# EAGLE board MDB1986 (EAGLE 9.0.0)
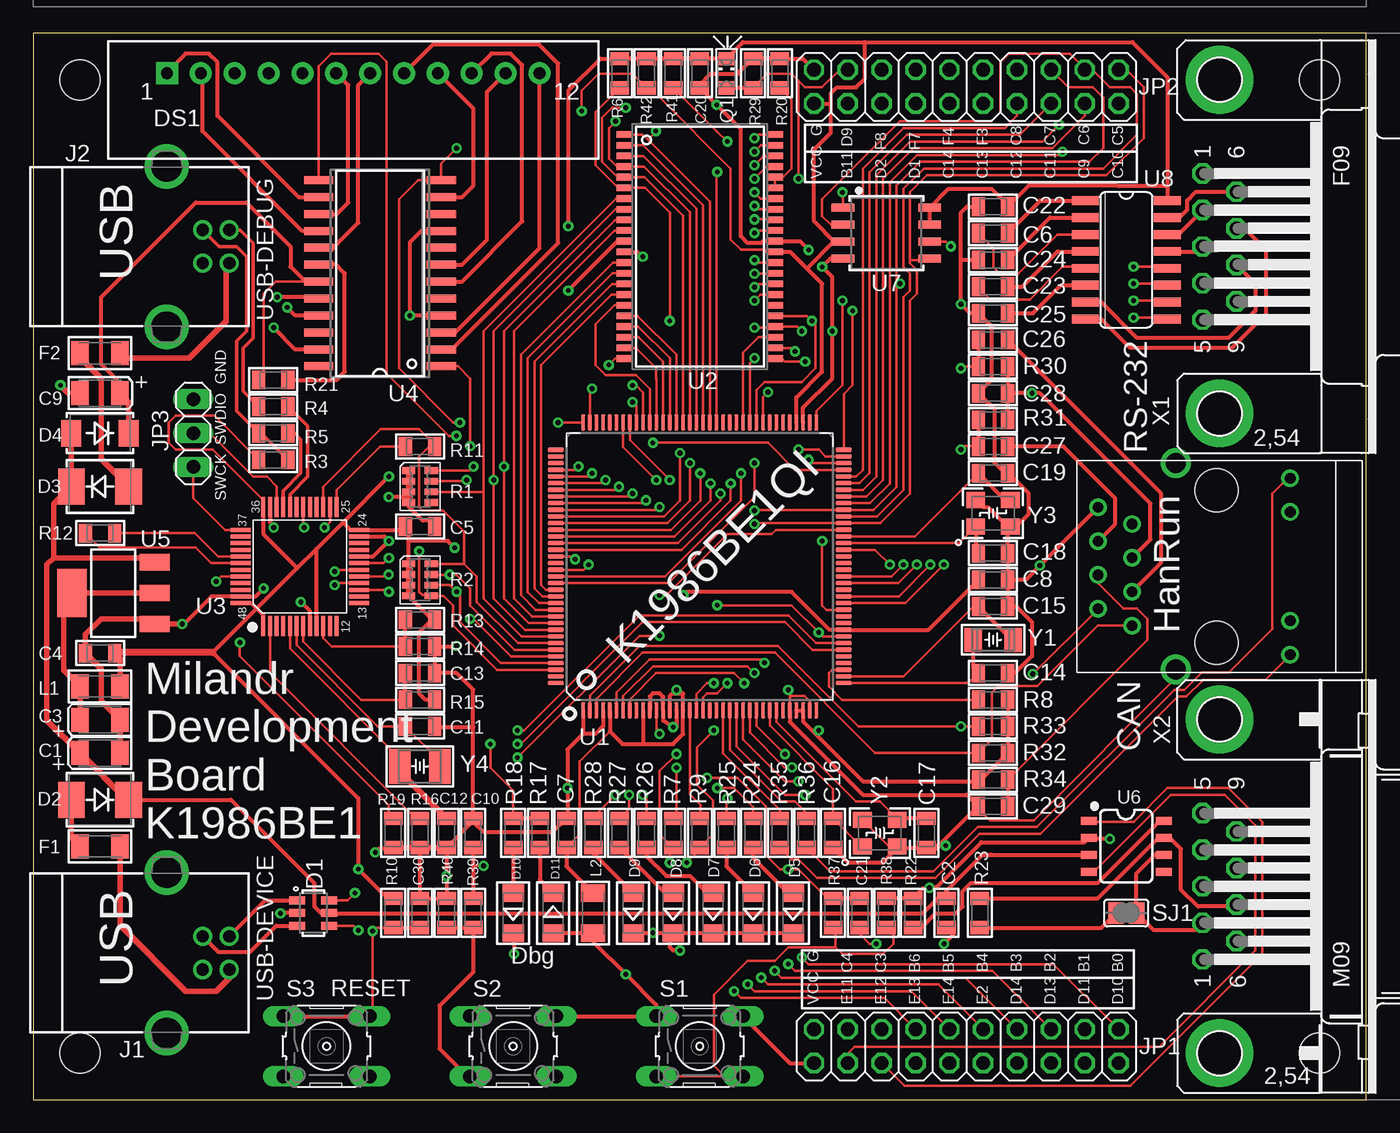
[diagram p1: board, top side]
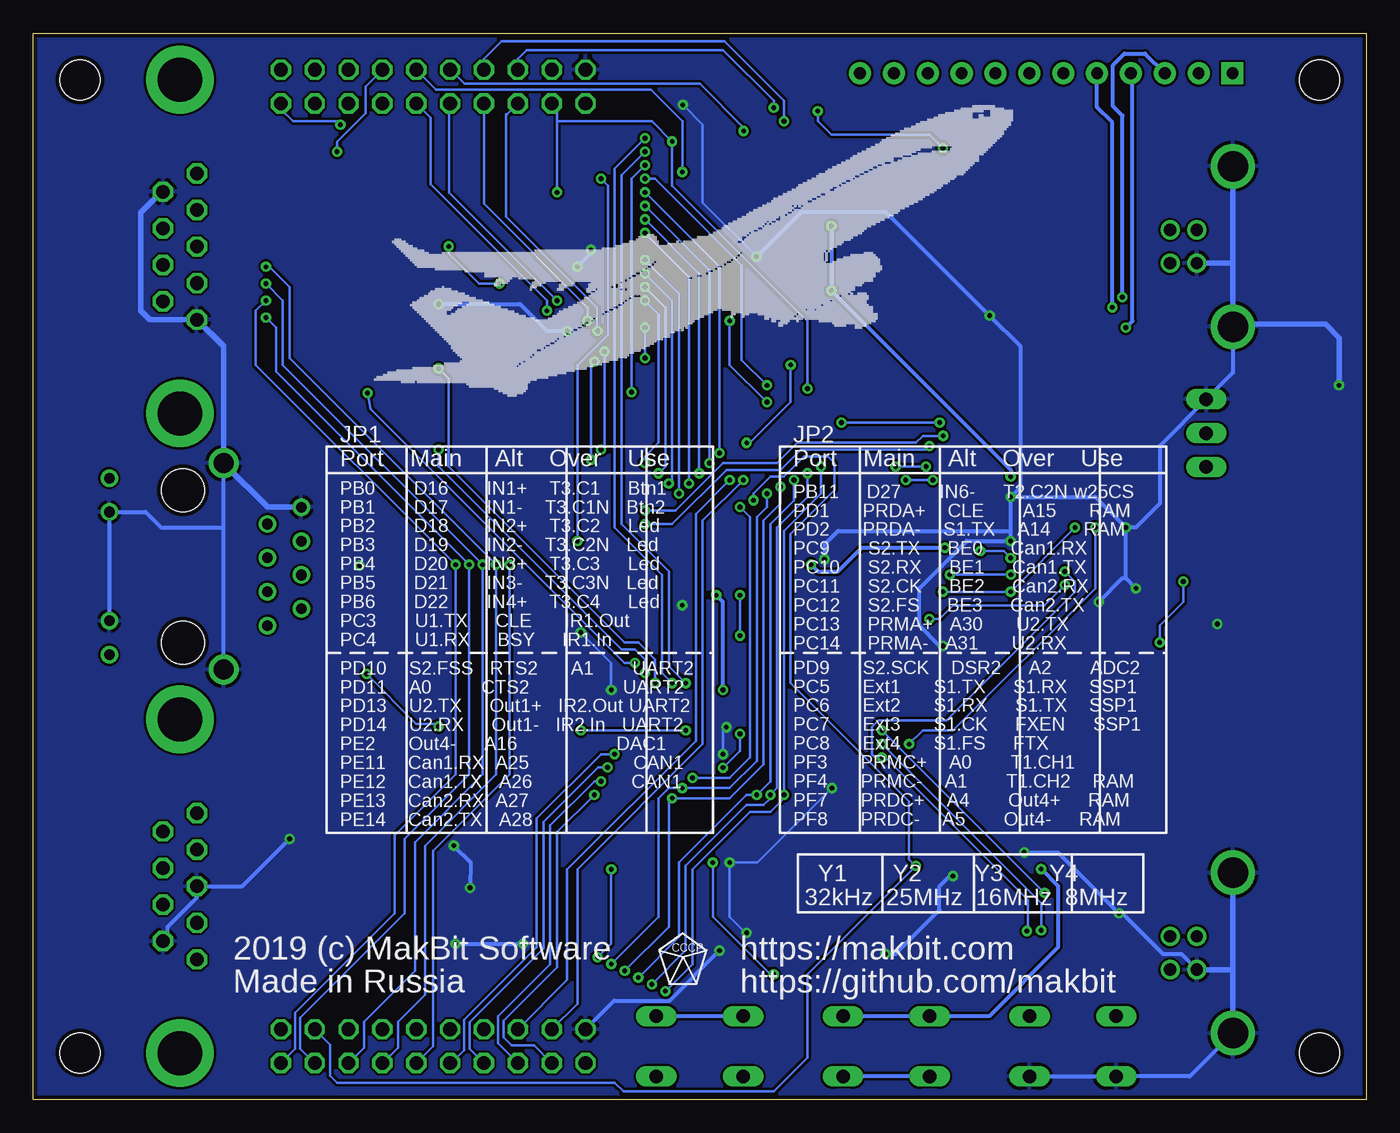
[diagram p2: board, bottom side, seen from below]

Size 100 x 80 mm. Coordinates in mm from the lower left corner, seen from the top.
Outline: 0,0 100,0 100,80 0,80 0,0
Copper layers (1*16): Top 0.035mm / dielectric 1.5mm / Bottom 0.035mm
Design rules "default *": minimum track width 8mil, minimum drill 0.35mm, track to track 7mil, track to pad 7mil, pad to pad 7mil, via to via 7mil, smd to smd 7mil, copper to edge 12mil, drill to drill 8mil, minimum pad ring 10mil, minimum via ring 8mil, stop-mask expansion 4mil, vias tented up to drill 14mil, thermal gap 10mil
Holes 3 mm at 96.5,76.5 96.5,3.5 3.5,3.5 3.5,76.5

## Footprints (pad centres in the part's own frame; a part is rotated, then mirrored left to right if it is on the bottom)
RCL-1206F-POL = smd 1.3 x 1.8: + 1.5,0; - -1.5,0
RCL-0805F = smd 1 x 1.4: 1 -1.1,0; 2 1.1,0
SOT-23-6L = smd 0.6 x 1.2: 1 -0.95,-1.2; 2 0,-1.2; 3 0.95,-1.2; 4 0.95,1.2; 5 0,1.2; 6 -0.95,1.2
DO-214AA(SMB) = smd 2 x 2.7: A -2.15,0; C 2.15,0
DO-214AC(SMA) = smd 1.5 x 2: A -2.15,0; C 2.15,0
LED-1206F = smd 1.3 x 1.6: A -1.5,0; C 1.5,0
LED-7SEG-12P2.54 = drill 0.889 pad 1.651 square: 1 -13.97,2 | drill 0.889 pad 1.651: 2 -11.43,2; 3 -8.89,2; 4 -6.35,2; 5 -3.81,2; 6 -1.27,2; 7 1.27,2; 8 3.81,2; 9 6.35,2; 10 8.89,2; 11 11.43,2; 12 13.97,2
RCL-1206F = smd 1.3 x 1.8: 1 -1.5,0; 2 1.5,0
USB-TYPE-B-4P = drill 0.92 pad 1.27: 1_VBUS 4.71,-1.25; 2_DM 4.71,1.25; 3_DP 2.71,1.25; 4_GND 2.71,-1.25 | drill 2.3 pad 3: M1 0,6.02; M2 0,-6.02
2X10 = drill 1.016 octagon: 1 -11.43,-1.27; 2 -11.43,1.27; 3 -8.89,-1.27; 4 -8.89,1.27; 5 -6.35,-1.27; 6 -6.35,1.27; 7 -3.81,-1.27; 8 -3.81,1.27; 9 -1.27,-1.27; 10 -1.27,1.27; 11 1.27,-1.27; 12 1.27,1.27; 13 3.81,-1.27; 14 3.81,1.27; 15 6.35,-1.27; 16 6.35,1.27; 17 8.89,-1.27; 18 8.89,1.27; 19 11.43,-1.27; 20 11.43,1.27
1X03 = drill 1.016 long: 1 -2.54,0; 2 0,0; 3 2.54,0
PT17-21C-L41-TR8 = smd 1.2 x 1: C 0,1.1; E 0,-1.1
RA-1206-X4 = smd 0.5 x 1: 1 -1.2,-0.85; 2 -0.4,-0.85; 3 0.4,-0.85; 4 1.2,-0.85; 5 1.2,0.85; 6 0.4,0.85; 7 -0.4,0.85; 8 -1.2,0.85
BUTTON-B3F-10XX = drill 1.016 long: 1 -3.251,2.261; 2 3.251,2.261; 3 -3.251,-2.261; 4 3.251,-2.261
SJ = smd 1.168 x 1.6: 1 -0.762,0; 2 0.762,0
LQFP144-0.5-20X20M = smd 0.3 x 1.2: 1 -8.75,-10.8; 2 -8.25,-10.8; 3 -7.75,-10.8; 4 -7.25,-10.8; 5 -6.75,-10.8; 6 -6.25,-10.8; 7 -5.75,-10.8; 8 -5.25,-10.8; 9 -4.75,-10.8; 10 -4.25,-10.8; 11 -3.75,-10.8; 12 -3.25,-10.8; 13 -2.75,-10.8; 14 -2.25,-10.8; 15 -1.75,-10.8; 16 -1.25,-10.8; 17 -0.75,-10.8; 18 -0.25,-10.8; 19 0.25,-10.8; 20 0.75,-10.8; 21 1.25,-10.8; 22 1.75,-10.8; 23 2.25,-10.8; 24 2.75,-10.8; 25 3.25,-10.8; 26 3.75,-10.8; 27 4.25,-10.8; 28 4.75,-10.8; 29 5.25,-10.8; 30 5.75,-10.8; 31 6.25,-10.8; 32 6.75,-10.8; 33 7.25,-10.8; 34 7.75,-10.8; 35 8.25,-10.8; 36 8.75,-10.8; 73 8.75,10.8; 74 8.25,10.8; 75 7.75,10.8; 76 7.25,10.8; 77 6.75,10.8; 78 6.25,10.8; 79 5.75,10.8; 80 5.25,10.8; 81 4.75,10.8; 82 4.25,10.8; 83 3.75,10.8; 84 3.25,10.8; 85 2.75,10.8; 86 2.25,10.8; 87 1.75,10.8; 88 1.25,10.8; 89 0.75,10.8; 90 0.25,10.8; 91 -0.25,10.8; 92 -0.75,10.8; 93 -1.25,10.8; 94 -1.75,10.8; 95 -2.25,10.8; 96 -2.75,10.8; 97 -3.25,10.8; 98 -3.75,10.8; 99 -4.25,10.8; 100 -4.75,10.8; 101 -5.25,10.8; 102 -5.75,10.8; 103 -6.25,10.8; 104 -6.75,10.8; 105 -7.25,10.8; 106 -7.75,10.8; 107 -8.25,10.8; 108 -8.75,10.8 | smd 1.2 x 0.3: 37 10.8,-8.75; 38 10.8,-8.25; 39 10.8,-7.75; 40 10.8,-7.25; 41 10.8,-6.75; 42 10.8,-6.25; 43 10.8,-5.75; 44 10.8,-5.25; 45 10.8,-4.75; 46 10.8,-4.25; 47 10.8,-3.75; 48 10.8,-3.25; 49 10.8,-2.75; 50 10.8,-2.25; 51 10.8,-1.75; 52 10.8,-1.25; 53 10.8,-0.75; 54 10.8,-0.25; 55 10.8,0.25; 56 10.8,0.75; 57 10.8,1.25; 58 10.8,1.75; 59 10.8,2.25; 60 10.8,2.75; 61 10.8,3.25; 62 10.8,3.75; 63 10.8,4.25; 64 10.8,4.75; 65 10.8,5.25; 66 10.8,5.75; 67 10.8,6.25; 68 10.8,6.75; 69 10.8,7.25; 70 10.8,7.75; 71 10.8,8.25; 72 10.8,8.75; 109 -10.8,8.75; 110 -10.8,8.25; 111 -10.8,7.75; 112 -10.8,7.25; 113 -10.8,6.75; 114 -10.8,6.25; 115 -10.8,5.75; 116 -10.8,5.25; 117 -10.8,4.75; 118 -10.8,4.25; 119 -10.8,3.75; 120 -10.8,3.25; 121 -10.8,2.75; 122 -10.8,2.25; 123 -10.8,1.75; 124 -10.8,1.25; 125 -10.8,0.75; 126 -10.8,0.25; 127 -10.8,-0.25; 128 -10.8,-0.75; 129 -10.8,-1.25; 130 -10.8,-1.75; 131 -10.8,-2.25; 132 -10.8,-2.75; 133 -10.8,-3.25; 134 -10.8,-3.75; 135 -10.8,-4.25; 136 -10.8,-4.75; 137 -10.8,-5.25; 138 -10.8,-5.75; 139 -10.8,-6.25; 140 -10.8,-6.75; 141 -10.8,-7.25; 142 -10.8,-7.75; 143 -10.8,-8.25; 144 -10.8,-8.75
TSOP2-44-400BF = smd 0.5 x 1.2: 1 -8.4,-5.627; 2 -7.6,-5.627; 3 -6.8,-5.627; 4 -6,-5.627; 5 -5.2,-5.627; 6 -4.4,-5.627; 7 -3.6,-5.627; 8 -2.8,-5.627; 9 -2,-5.627; 10 -1.2,-5.627; 11 -0.4,-5.627; 12 0.4,-5.627; 13 1.2,-5.627; 14 2,-5.627; 15 2.8,-5.627; 16 3.6,-5.627; 17 4.4,-5.627; 18 5.2,-5.627; 19 6,-5.627; 20 6.8,-5.627; 21 7.6,-5.627; 22 8.4,-5.627; 23 8.4,5.627; 24 7.6,5.627; 25 6.8,5.627; 26 6,5.627; 27 5.2,5.627; 28 4.4,5.627; 29 3.6,5.627; 30 2.8,5.627; 31 2,5.627; 32 1.2,5.627; 33 0.4,5.627; 34 -0.4,5.627; 35 -1.2,5.627; 36 -2,5.627; 37 -2.8,5.627; 38 -3.6,5.627; 39 -4.4,5.627; 40 -5.2,5.627; 41 -6,5.627; 42 -6.8,5.627; 43 -7.6,5.627; 44 -8.4,5.627
LQFP48-0.5-7X7MM = smd 1.5 x 0.3: 1 -4.45,2.75; 2 -4.45,2.25; 3 -4.45,1.75; 4 -4.45,1.25; 5 -4.45,0.75; 6 -4.45,0.25; 7 -4.45,-0.25; 8 -4.45,-0.75; 9 -4.45,-1.25; 10 -4.45,-1.75; 11 -4.45,-2.25; 12 -4.45,-2.75; 25 4.45,-2.75; 26 4.45,-2.25; 27 4.45,-1.75; 28 4.45,-1.25; 29 4.45,-0.75; 30 4.45,-0.25; 31 4.45,0.25; 32 4.45,0.75; 33 4.45,1.25; 34 4.45,1.75; 35 4.45,2.25; 36 4.45,2.75 | smd 0.3 x 1.5: 13 -2.75,-4.45; 14 -2.25,-4.45; 15 -1.75,-4.45; 16 -1.25,-4.45; 17 -0.75,-4.45; 18 -0.25,-4.45; 19 0.25,-4.45; 20 0.75,-4.45; 21 1.25,-4.45; 22 1.75,-4.45; 23 2.25,-4.45; 24 2.75,-4.45; 37 2.75,4.45; 38 2.25,4.45; 39 1.75,4.45; 40 1.25,4.45; 41 0.75,4.45; 42 0.25,4.45; 43 -0.25,4.45; 44 -0.75,4.45; 45 -1.25,4.45; 46 -1.75,4.45; 47 -2.25,4.45; 48 -2.75,4.45
SO24W = smd 0.6 x 2.2: 1 -6.985,-4.6; 2 -5.715,-4.6; 3 -4.445,-4.6; 4 -3.175,-4.6; 5 -1.905,-4.6; 6 -0.635,-4.6; 7 0.635,-4.6; 8 1.905,-4.6; 9 3.175,-4.6; 10 4.445,-4.6; 11 5.715,-4.6; 12 6.985,-4.6; 13 6.985,4.6; 14 5.715,4.6; 15 4.445,4.6; 16 3.175,4.6; 17 1.905,4.6; 18 0.635,4.6; 19 -0.635,4.6; 20 -1.905,4.6; 21 -3.175,4.6; 22 -4.445,4.6; 23 -5.715,4.6; 24 -6.985,4.6
SOT223 = smd 1.219 x 2.235: 1 -2.311,-3.099; 2 0,-3.099; 3 2.311,-3.099 | smd 3.6 x 2.2: 4 0,3.099
SO08 = smd 0.6 x 1.2: 1 -1.905,-2.8; 2 -0.635,-2.8; 3 0.635,-2.8; 4 1.905,-2.8; 5 1.905,2.8; 6 0.635,2.8; 7 -0.635,2.8; 8 -1.905,2.8
SOIC-8 = smd 0.61 x 1.702: 1 -1.905,-3.251; 2 -0.635,-3.251; 3 0.635,-3.251; 4 1.905,-3.251; 5 1.905,3.251; 6 0.635,3.251; 7 -0.635,3.251; 8 -1.905,3.251
SO16 = smd 0.66 x 2.032: 1 -4.445,-3.073; 2 -3.175,-3.073; 3 -1.905,-3.073; 4 -0.635,-3.073; 5 0.635,-3.073; 6 1.905,-3.073; 7 3.175,-3.073; 8 4.445,-3.073; 9 4.445,3.073; 10 3.175,3.073; 11 1.905,3.073; 12 0.635,3.073; 13 -0.635,3.073; 14 -1.905,3.073; 15 -3.175,3.073; 16 -4.445,3.073
F09HP = drill 1.016 octagon: 1 -5.486,-1.27; 2 -2.743,-1.27; 3 0,-1.27; 4 2.743,-1.27; 5 5.486,-1.27; 6 -4.115,1.27; 7 -1.372,1.27; 8 1.372,1.27; 9 4.115,1.27 | drill 3.302 pad 5.08: G1 -12.522,0; G2 12.522,0
M09HP = drill 1.016 octagon: 1 -5.486,1.27; 2 -2.743,1.27; 3 0,1.27; 4 2.743,1.27; 5 5.486,1.27; 6 -4.115,-1.27; 7 -1.372,-1.27; 8 1.372,-1.27; 9 4.115,-1.27 | drill 3.302 pad 5.08: G1 -12.522,0; G2 12.522,0
RJ45 = drill 0.8: P1 4.44,-6.57; P2 3.18,-9.11; P3 1.9,-6.57; P4 0.64,-9.11; P5 -0.64,-6.57; P6 -1.9,-9.11; P7 -3.18,-6.57; P8 -4.44,-9.11; P9 6.625,5.3; P10 4.085,5.3; P11 -4.085,5.3; P12 -6.625,5.3 | drill 1.5: SHIELD1 7.745,-3.27; SHIELD2 -7.745,-3.27 | hole 3.25: -5.715,-0.22; 5.715,-0.22
XTAL-FC-135 = smd 1.3 x 1.8: 1 -1.5,0; 2 1.5,0
XTAL-FA-238 = smd 1.4 x 1.2: 1 -1.3,-1; 2 1.3,-1; 3 1.3,1; 4 -1.3,1
XTAL-NX3225 = smd 1.6 x 2.6: 1 -1.5,0; 2 1.5,0

## Placement (x,y rotation side)
C1  10u  [RCL-1206F-POL]  5,26 180 top
C2  1u  [RCL-0805F]  68.5,14 270 top
C3  10u  [RCL-1206F-POL]  5,28.5 180 top
C4  1u  [RCL-0805F]  5,33.5 180 top
C5  1u  [RCL-0805F]  29,43 0 top
C6  1u  [RCL-0805F]  72,67 180 top
C7  100n  [RCL-0805F]  40,20 90 top
C8  100n  [RCL-0805F]  72,39 0 top
C9  10u  [RCL-1206F-POL]  5,53 0 top
C10  100n  [RCL-0805F]  33,20 90 top
C11  12p  [RCL-0805F]  29,28 180 top
C12  12p  [RCL-0805F]  31,20 90 top
C13  100n  [RCL-0805F]  29,32 0 top
C14  12p  [RCL-0805F]  72,32 0 top
C15  12p  [RCL-0805F]  72,37 0 top
C16  12p  [RCL-0805F]  60,20 90 top
C17  12p  [RCL-0805F]  67,20 270 top
C18  12p  [RCL-0805F]  72,41 180 top
C19  12p  [RCL-0805F]  72,47 0 top
C20  1u  [RCL-0805F]  50,77 270 top
C21  100n  [RCL-0805F]  62,14 270 top
C22  100n  [RCL-0805F]  72,65 0 top
C23  100n  [RCL-0805F]  72,61 0 top
C24  100n  [RCL-0805F]  72,63 180 top
C25  100n  [RCL-0805F]  72,59 180 top
C26  6.8n  [RCL-0805F]  72,57 0 top
C27  [RCL-0805F]  72,49 0 top
C28  10n  [RCL-0805F]  72,53 180 top
C29  22n  [RCL-0805F]  72,22 0 top
C30  100n  [RCL-0805F]  29,14 90 top
D1  USBLC6-2SC6  [SOT-23-6L]  21,14 270 top
D2  [DO-214AA(SMB)]  5,22.5 0 top
D3  [DO-214AA(SMB)]  5,46 180 top
D4  RS1A  [DO-214AC(SMA)]  5,50 0 top
D5  [LED-1206F]  57,14 270 top
D6  [LED-1206F]  54,14 270 top
D7  [LED-1206F]  51,14 270 top
D8  [LED-1206F]  48,14 270 top
D9  [LED-1206F]  45,14 270 top
D10  [LED-1206F]  36,14 270 top
D11  [LED-1206F]  39,14 90 top
DS1  LED-7SEG-12PIN-CC  [LED-7SEG-12P2.54]  24,75 0 top
F1  [RCL-1206F]  5,19 180 top
F2  [RCL-1206F]  5,56 180 top
J1  USB-TYPE-B  [USB-TYPE-B-4P]  10,11 0 top
J2  USB-TYPE-B  [USB-TYPE-B-4P]  10,64 0 top
JP1  [2X10]  70,4 0 top
JP2  [2X10]  70,76 0 top
JP3  [1X03]  12,50 90 top
L1  BLM31PG  [RCL-1206F]  5,31 0 top
L2  [RCL-1206F]  42,14 90 top
Q1  [PT17-21C-L41-TR8]  52,77 0 top
R1  10k  [RA-1206-X4]  29,46 270 top
R2  10k  [RA-1206-X4]  29,39 270 top
R3  1k5  [RCL-0805F]  18,48 0 top
R4  [RCL-0805F]  18,52 0 top
R5  22  [RCL-0805F]  18,50 0 top
R6  [RCL-0805F]  44,77 90 top
R7  12k4  [RCL-0805F]  48,20 90 top
R8  [RCL-0805F]  72,30 180 top
R9  10k  [RCL-0805F]  50,20 90 top
R10  10k  [RCL-0805F]  27,14 90 top
R11  220  [RCL-0805F]  29,49 180 top
R12  220  [RCL-0805F]  5,42.5 180 top
R13  4k7  [RCL-0805F]  29,36 0 top
R14  4k7  [RCL-0805F]  29,34 180 top
R15  47k  [RCL-0805F]  29,30 180 top
R16  47k  [RCL-0805F]  29,20 270 top
R17  1k  [RCL-0805F]  38,20 270 top
R18  1k  [RCL-0805F]  36,20 270 top
R19  47k  [RCL-0805F]  27,20 270 top
R20  47k  [RCL-0805F]  56,77 90 top
R21  47k  [RCL-0805F]  18,54 0 top
R22  10k  [RCL-0805F]  66,14 90 top
R23  120  [RCL-0805F]  71,14 270 top
R24  1k  [RCL-0805F]  54,20 270 top
R25  1k  [RCL-0805F]  52,20 270 top
R26  1k  [RCL-0805F]  46,20 270 top
R27  1k  [RCL-0805F]  44,20 270 top
R28  1k  [RCL-0805F]  42,20 270 top
R29  10k  [RCL-0805F]  54,77 90 top
R30  82  [RCL-0805F]  72,55 180 top
R31  82  [RCL-0805F]  72,51 180 top
R32  50  [RCL-0805F]  72,26 0 top
R33  50  [RCL-0805F]  72,28 0 top
R34  10  [RCL-0805F]  72,24 180 top
R35  [RCL-0805F]  56,20 270 top
R36  1k  [RCL-0805F]  58,20 270 top
R37  10k  [RCL-0805F]  60,14 270 top
R38  47k  [RCL-0805F]  64,14 270 top
R39  10k  [RCL-0805F]  33,14 270 top
R40  47k  [RCL-0805F]  31,14 270 top
R41  [RCL-0805F]  48,77 270 top
R42  47k  [RCL-0805F]  46,77 270 top
S1  SWITCH-10-XX  [BUTTON-B3F-10XX]  50,4 0 top
S2  SWITCH-10-XX  [BUTTON-B3F-10XX]  36,4 0 top
S3  SWITCH-10-XX  [BUTTON-B3F-10XX]  22,4 0 top
SJ1  [SJ]  82,14 0 top
U1  [LQFP144-0.5-20X20M]  50,40 0 top
U2  IS61LV25616AL  [TSOP2-44-400BF]  50,64 270 top
U3  STM32F103CBT6-LQFP48  [LQFP48-0.5-7X7MM]  20,40 90 top
U4  MAX7221CWG  [SO24W]  26,62 90 top
U5  AMS1117-3.3  [SOT223]  6,38 90 top
U6  MCP2551  [SO08]  82,19 270 top
U7  W25Q64FV  [SOIC-8]  64,65 270 top
U8  MAX3232CSE  [SO16]  82,63 270 top
X1  DRB-9FA  [F09HP]  89,64 270 top
X2  DRB-9MA  [M09HP]  89,16 90 top
X3  [RJ45]  89,40 270 top
Y1  32.768kHz  [XTAL-FC-135]  72,34.5 0 top
Y2  25MHz  [XTAL-FA-238]  63.5,20 0 top
Y3  16MHz  [XTAL-FA-238]  72,44 0 top
Y4  8MHz  [XTAL-NX3225]  29,25 180 top

## Tracks (layer width: path | path; a pad name or v marks a point on that pad's centre or on a via)
!RESET  (via drill 0.36)
  Top 0.203: v46.99,34.8 45.47,34.8 v36.32,25.65 | R10.1 25.73,12.9 v25.46,12.63 25.46,6.47 S3.2 | U1.60 55.7,42.75 55.37,42.42 52.07,42.42 47.5,37.85 v46.99,37.85 | v22.61,39.62 22.73,39.75 U3.18
  Top 0.305: R10.1 C30.1 | S3.1 S3.2
  Bottom 0.203: v25.46,12.63 25.4,12.7 25.4,14.99 36.07,25.65 v36.32,25.65 36.83,25.65 37.08,25.91 37.08,27.94 36.58,28.45 31.5,28.45 21.84,38.1 21.84,38.86 v22.61,39.62 | v46.99,37.85 v46.99,34.8
+3V3  (via drill 0.36)
  Top 0.203: U1.127 41.27,39.75 v41.66,40.13 | U3.36 17.25,44.94 17.27,44.96 | R3.1 13.59,51.31 10.67,51.31 10.16,50.8 10.16,49.28 10.67,48.77 13.46,48.77 17.25,44.98 | U2.33 55.02,63.6 54.86,63.75 53.09,63.75 52.32,64.52 52.32,69.85 47.02,75.15 47.02,78.07 46.99,78.1 | 49.02,17.53 v49.02,17.78 50,18.76 R9.1 50.98,19.88 50.98,22.43 49.78,23.62 49.78,26.42 v51.05,27.69 | 41.91,12.25 41.66,12.5 | v58.93,27.69 58.67,27.43
  Top 0.254: 17.27,35.57 U3.1
  Top 0.305: 15.24,37.25 U3.48 16.34,37.25 16.76,36.83 | 28.24,37.8 R2.4 29.93,36.02 | U1.33 U1.34 57.75,28.36 58.67,27.43 62.23,23.88 70.98,23.88 71.1,24 | 17.25,44.98 U3.36 17.25,42.44 19.81,39.88 | D11.A 41.66,12.5 L2.1 42,11.85 v44.45,9.4 46.74,7.11 46.74,6.26 | R10.2 26.57,15.1 v24.38,17.29 24.38,22.61 13.46,33.53 16.76,36.83 | 6.13,33.53 C4.1 | 29.93,36.02 29.95,36 R13.2 | R15.1 29.44,30 28.96,30.48 28.96,35.05 29.93,36.02 | 28.19,40.24 R2.1 28.15,41.91 | R34.2 71.1,24 | 71.1,24 R32.2 R33.2 R8.1 | v31.6,41.4 31.09,41.91 28.15,41.91 | 27.76,42.86 27.65,42.75 U3.24 23.8,42.75 23.24,43.31 | 27.76,42.86 C5.1 | 28.15,41.91 28.15,42.46 27.76,42.86 | U3.1 17.25,36.34 16.76,36.83 | 16.76,36.83 19.81,39.88 | 19.81,39.88 21.25,41.32 | 21.25,41.32 23.24,43.31 | 23.24,43.31 v26.67,46.74 | U3.9 21.25,41.32 | U2.11 43.83,64.4 v40.13,60.71 | v40.13,65.53 40.13,75.69 42.54,78.1 R6.2 R42.1 46.99,78.1 R41.1 C20.1 Q1.C 53.24,79.34 62.38,79.34 | U7.7 U7.8 68.67,68.33 71.88,68.33 73.1,67.11 C6.1 74.68,68.58 81.03,68.58 81.28,68.58 85.07,68.58 | U1.76 57.25,52.68 59.18,54.61 59.18,61.21 58.04,62.36 | U2.33 56.8,63.6 58.04,62.36 | 58.04,62.36 60.05,64.36 U7.3 60.65,64.26 60.2,64.26 58.57,65.89 58.57,71.27 59.84,72.54 59.84,74.68 59.79,74.73 | JP2.1 59.79,74.73 | 62.38,79.34 82.46,79.34 85.07,76.72 85.07,68.58 | 59.79,74.73 59.84,74.78 59.84,75.49 60.3,75.95 61.72,75.95 62.38,76.61 62.38,79.34 | 39,6.51 S2.2 46.74,6.26 | 46.74,6.26 S1.1 | S1.2 56.78,2.73 JP1.1 | 85.07,68.58 U8.16
  Top 0.406: R2.4 R2.3 R2.2 R2.1 | L1.2 6.5,33.1 C4.1
  Top 0.508: 13.46,33.53 6.13,33.53
  Bottom 0.203: v51.05,27.69 58.67,27.69 58.93,27.94 v58.93,27.69 | v49.02,17.78 49.02,13.72 44.7,9.4 v44.45,9.4
  Bottom 0.305: v41.66,40.13 41.15,39.62 39.62,39.62 37.85,41.4 v31.6,41.4 | v26.67,46.74 26.67,47.24 v40.13,60.71 v40.13,65.53 | v24.38,17.29 23.11,16.02 23.11,11.43 28.28,6.26 S2.1 S2.2 | S1.1 S1.2
+4V
  Top 0.203: R21.1 17.27,54.37 17.27,60.45 18.18,61.37 20.57,61.37 U4.19
  Top 0.305: C9.+ 6.5,53.75 5.08,55.17 5.08,60.2 12.19,67.31 16,67.31 19.3,64.01 19.3,62.48 20.42,61.37 20.57,61.37
  Top 0.406: D4.C 7.15,52.35 C9.+
A0  (via drill 0.36)
  Top 0.203: v51.31,69.6 51.25,69.54 U1.88
  Bottom 0.203: JP2.12 69.77,75.77 53.67,75.77 51.31,73.41 v51.31,69.6
A1  (via drill 0.36)
  Top 0.203: U2.1 45.71,72.4 46.1,72.01 | U1.89 50.75,67.36 46.1,72.01 | v46.71,72.67 46.71,72.61 46.1,72.01
  Bottom 0.203: JP2.10 67.66,76.2 49.98,76.2 46.71,72.93 v46.71,72.67
A2
  Top 0.203: U2.2 45.75,71.6 50.25,67.1 U1.90
A3
  Top 0.203: U2.3 45.79,70.8 49.75,66.84 U1.91
A4  (via drill 0.36)
  Top 0.203: U1.92 49.25,66.57 45.82,70 U2.4 43.79,70 43.18,70.61 43.18,72.9 v43.69,73.41
  Bottom 0.203: JP2.8 66.19,78.08 64.88,79.39 48.15,79.39 43.69,74.93 v43.69,73.41
A5  (via drill 0.36)
  Top 0.203: U1.93 48.75,66.31 45.86,69.2 U2.5 43.83,69.2 42.67,70.36 42.67,73.66 43.43,74.42 v44.45,74.42
  Bottom 0.203: JP2.6 63.65,78.08 62.99,78.74 48.26,78.74 44.45,74.93 v44.45,74.42
A6
  Top 0.203: U1.94 48.25,53.34 48.25,53.6 48.25,55.89 45.34,58.8 U2.18
A7
  Top 0.203: U1.95 47.75,53.09 47.75,53.34 47.75,55.63 45.38,58 U2.19
A8
  Top 0.203: U2.20 45.42,57.2 47.25,55.37 U1.96
A9
  Top 0.203: U1.97 46.75,54.09 46.74,54.1 46.74,54.86 45.2,56.4 U2.21
A10  (via drill 0.36)
  Top 0.203: U1.69 57.14,47.25 55.12,49.28 v46.48,49.28 | v43.18,55.12 43.66,55.6 U2.22
  Bottom 0.203: v46.48,49.28 46.23,49.28 43.18,52.32 v43.18,55.12
A11  (via drill 0.36)
  Top 0.203: U1.70 58.42,47.75 v58.17,48.01 | U2.23 56.16,55.6 56.39,55.37 v57.91,55.37
  Bottom 0.203: v57.91,55.37 58.17,55.12 v58.17,48.01
A12  (via drill 0.36)
  Top 0.203: U1.71 59.45,48.25 58.93,48.77 v57.4,48.77 | U2.24 56.88,56.4 v57.15,56.13
  Bottom 0.203: v57.4,48.77 57.15,49.02 v57.15,56.13
A13
  Top 0.203: U1.84 53.25,56.04 54.41,57.2 U2.25
A14  (via drill 0.36)
  Top 0.203: U1.83 53.75,55.27 v54.1,55.63 | v54.1,57.91 55.54,57.91 U2.26 57.32,58 v57.66,57.66
  Bottom 0.203: v54.1,55.63 v54.1,57.91 | JP2.5 64.47,73.91 64.52,73.91 64.52,66.24 57.71,59.44 57.71,57.71 v57.66,57.66
A15  (via drill 0.36)
  Top 0.203: U1.82 54.25,53.23 54.86,53.85 57.66,53.85 58.67,54.86 58.67,58.17 v58.42,58.42 58.04,58.8 U2.27
  Bottom 0.203: v58.42,58.42 58.42,59.44 66.19,67.21 JP2.7
A16  (via drill 0.36)
  Top 0.203: U1.81 54.75,52.72 v55.12,53.09 | 55.56,70.87 U2.42 54.8,70.8 v54.1,70.1
  Bottom 0.203: v55.12,53.09 55.12,69.09 v54.1,70.1
A17  (via drill 0.36)
  Top 0.203: U1.18 49.75,30.45 50.55,31.24 v51.05,31.24 | U2.43 54.58,71.6 v54.1,71.12
  Bottom 0.203: v51.05,31.24 52.32,32.51 52.32,39.62 55.88,43.18 55.88,69.34 v54.1,71.12
A18  (via drill 0.36)
  Top 0.203: 55.62,72.39 U2.44 54.37,72.4 v54.1,72.14 | U1.19 50.25,30.18 50.55,30.48 51.31,30.48 v52.07,31.24
  Bottom 0.203: v52.07,31.24 52.83,32 52.83,39.37 56.39,42.93 56.39,69.85 v54.1,72.14
ADC2  (via drill 0.36)
  Top 0.203: U1.48 59.52,36.75 59.18,37.08 v59.18,41.91 | R29.1 55.06,76.96 56.9,76.96 57.4,76.45 | 57.4,76.45 v57.4,69.09 | 57.4,76.45 57.91,75.95 59.18,75.95 60.51,77.27 JP2.4
  Top 0.305: Q1.E R29.1
  Bottom 0.203: v59.18,41.91 59.18,55.12 56.9,57.4 56.9,68.58 v57.4,69.09
AIN
  Top 0.203: U3.10 21.75,34.64 22.39,34 R14.2
  Top 0.305: R14.2 R13.1
BOOT0  (via drill 0.36)
  Top 0.203: R19.1 26.67,21.43 26.67,22.1 15.49,33.27 v15.49,34.29 | v13.72,38.86 14.1,39.25 U3.44
  Bottom 0.203: v15.49,34.29 15.49,35.56 13.72,37.34 v13.72,38.86
CAN_H
  Top 0.305: X2.7 89.81,14.63 89.66,14.48 87.38,14.48 86.11,15.75 86.11,18.8 85.27,19.64 U6.7 84.41,19.64 79.87,15.1 R23.1
CAN_L
  Top 0.305: X2.2 87.17,12.7 84.06,12.7 SJ1.2 82.76,16.98 84.15,18.36 U6.6
CAN_RX1  (via drill 0.36)
  Top 0.203: U1.24 52.75,26.5 56.39,22.86 v57.91,22.86 | U6.4 79.58,17.09 85.34,22.86 89.41,22.86 91.69,20.57 91.69,11.18 84.48,3.96 61.62,3.96 60.96,3.3 61.11,3.15 JP1.3
  Bottom 0.203: v57.91,22.86 60.71,20.07 60.71,9.91 64.72,5.89 64.72,4.67 64.11,4.06 62.44,4.06 JP1.3
CAN_RX2  (via drill 0.36)
  Top 0.203: U1.26 53.75,27.53 56.36,24.92 v56.93,24.92
  Bottom 0.203: v56.93,24.92 57.63,24.92 61.72,20.83 61.72,11.33 67.26,5.79 67.26,3.8 JP1.7
CAN_TX1  (via drill 0.36)
  Top 0.203: U1.25 53.25,27.01 56.39,23.88 v57.4,23.88 | U6.1 79.28,20.83 82.55,20.83 85.09,23.37 89.66,23.37 92.2,20.83 92.2,10.92 82.3,1.02 65.36,1.02 JP1.5
  Bottom 0.203: v57.4,23.88 57.91,23.88 61.21,20.57 61.21,10.16 65.13,6.25 65.13,4.21 JP1.5
CAN_TX2  (via drill 0.36)
  Top 0.203: U1.27 54.25,28.05 v56.39,25.91
  Bottom 0.203: v56.39,25.91 57.4,25.91 62.23,21.08 62.23,11.43 67.69,5.97 67.69,3.69 68.64,2.73 JP1.9
CE  (via drill 0.36)
  Top 0.203: v47.75,58.42 47.75,66.55 45.9,68.4 U2.6 43.87,68.4 42.16,70.1 42.16,74.06 R6.1 | U1.100 45.25,52.03 v44.96,52.32
  Bottom 0.203: v47.75,58.42 47.75,55.12 v44.96,52.32
D0
  Top 0.203: U1.137 36.62,34.75 33.78,37.59 33.78,45.62 | U2.7 43.72,67.6 33.78,57.66 33.78,45.62 | R1.6 33.76,45.6 33.78,45.62
D1  (via drill 0.36)
  Top 0.203: U1.136 36.89,35.25 34.54,37.59 v34.54,46.48 34.54,57.66 43.69,66.8 U2.8 | R1.7 32.43,46.4 v32.51,46.48
  Bottom 0.203: v32.51,46.48 v34.54,46.48
D2  (via drill 0.36)
  Top 0.203: U1.135 37.15,35.75 35.31,37.59 v35.31,47.5 35.31,57.66 43.65,66 U2.9 | R1.8 32.72,47.2 v33.02,47.5
  Bottom 0.203: v33.02,47.5 v35.31,47.5
D3
  Top 0.203: U1.134 37.41,36.25 36.07,37.59 36.07,57.66 43.61,65.2 U2.10
  Top 0.254: U1.134 39.18,36.27
D4
  Top 0.203: U1.133 37.67,36.75 36.58,37.85 36.58,55.88 43.5,62.8 U2.13
D5
  Top 0.203: U1.132 37.93,37.25 37.08,38.1 37.08,55.63 43.46,62 U2.14
D6
  Top 0.203: U1.131 38.2,37.75 37.59,38.35 37.59,55.37 43.42,61.2 U2.15
D7
  Top 0.203: U1.130 38.46,38.25 38.1,38.61 38.1,55.12 43.38,60.4 U2.16
D8  (via drill 0.36)
  Top 0.203: U2.29 54.56,60.4 v54.1,59.94 | v54.1,47.75 54.1,45.21 47.64,38.75 U1.129
  Bottom 0.203: v54.1,47.75 54.1,48.26 53.09,49.28 53.09,58.93 v54.1,59.94
D9  (via drill 0.36)
  Top 0.203: U2.30 54.34,61.2 v54.1,60.96 | v53.09,46.99 53.09,44.96 47.38,39.25 U1.128
  Bottom 0.203: v53.09,46.99 52.58,47.5 52.58,59.44 v54.1,60.96
D10  (via drill 0.36)
  Top 0.203: U1.124 48.62,41.25 52.32,44.96 v52.32,46.23 | U2.31 55.6,61.98 v54.1,61.98
  Bottom 0.203: v52.32,46.23 52.07,46.48 52.07,59.94 v54.1,61.98
D11  (via drill 0.36)
  Top 0.203: U1.123 48.35,41.75 51.56,44.96 v51.56,45.47 | U2.32 54.29,62.8 v54.1,62.99
  Bottom 0.203: v54.1,62.99 51.56,60.45 v51.56,45.47
D12  (via drill 0.36)
  Top 0.203: U1.122 48.09,42.25 50.8,44.96 v50.8,46.23 | U2.35 54.28,65.2 v54.1,65.02
  Bottom 0.203: v54.1,65.02 50.8,61.72 v50.8,46.23
D13  (via drill 0.36)
  Top 0.203: U1.121 47.83,42.75 50.04,44.96 v50.04,46.99 | U2.36 55.59,66.04 v54.1,66.04
  Bottom 0.203: v54.1,66.04 50.04,61.98 v50.04,46.99
D14  (via drill 0.36)
  Top 0.203: U1.120 47.57,43.25 49.28,44.96 v49.28,47.75 | U2.37 54.36,66.8 v54.1,67.06
  Bottom 0.203: v54.1,67.06 49.28,62.23 v49.28,47.75
D15  (via drill 0.36)
  Top 0.203: U1.119 47.31,43.75 48.51,44.96 v48.51,48.51 | U2.38 54.57,67.6 v54.1,68.07
  Bottom 0.203: v54.1,68.07 48.51,62.48 v48.51,48.51
DAC1  (via drill 0.36)
  Top 0.203: U1.57 63.14,41.25 v64.26,40.13
  Bottom 0.203: JP1.11 70,4 70,18.64 64.26,24.38 v64.26,40.13
ETH_CM  (via drill 0.36)
  Top 0.203: U1.6 43.75,30.54 46.23,33.02 54.61,33.02 v54.86,32.77
  Top 0.305: R30.1 C28.1 | R31.1 C28.1 | X3.P5 83.82,42.03 83.82,44.7 75.52,53 v74.93,53 C28.1
  Bottom 0.203: v74.93,53 74.68,51.82 55.63,32.77 v54.86,32.77
ETH_LED1
  Top 0.203: U1.22 51.75,27.94 51.75,27.75 51.75,25.97 56,21.72 R35.1
ETH_LED2
  Top 0.203: R36.1 58,21.5 57.15,22.35 56.13,22.35 52.25,26.24 U1.23
ETH_RXN  (via drill 0.36)
  Top 0.203: U1.7 44.25,30.28 46.48,32.51 53.59,32.51 v54.1,32 | v69.6,48.77 69.85,49.02 70.9,49.02
  Top 0.305: R31.2 70.9,49.02 C27.1
  Bottom 0.203: v69.6,48.77 69.6,47.5 55.88,33.78 54.86,33.78 54.1,33.02 v54.1,32
ETH_RXP  (via drill 0.36)
  Top 0.203: U1.8 44.75,30.02 46.74,32 52.58,32 v53.34,31.24 | v69.6,54.86 69.73,55 R30.2
  Top 0.305: C26.1 R30.2
  Bottom 0.203: v69.6,54.86 68.83,54.1 68.83,47.5 55.63,34.29 54.61,34.29 53.34,33.02 v53.34,31.24
ETH_TXN  (via drill 0.36)
  Top 0.203: U1.2 41.75,30.32 45.47,34.04 55.88,34.04 61.92,28 v69.6,28 R33.1 | v75,31.93 X3.P2
  Bottom 0.203: v75,31.93 71.26,28.19 69.79,28.19 v69.6,28
ETH_TXP
  Top 0.203: U1.3 42.25,30.06 45.72,33.53 55.63,33.53 63.15,26 R32.1 71.93,27.03 71.93,30.53 72.42,31.02 75.32,31.02 79.86,35.56 X3.P1
GND  (via drill 0.35, 0.36)
  Top 0.203: U1.125 40.43,40.75 v40.64,40.54 | U1.35 58.25,29.89 57.86,30.28 56.8,30.28 56.75,30.23 | 56.75,30.23 56.75,30.63 v56.64,30.73 | 56.75,30.23 U1.32 | Y2.4 64.2,19 Y2.2 | U1.44 59.23,34.75 v58.93,35.05 56.9,37.08 v51.31,37.08 | 51.14,74.76 v51.27,74.63 | 40.08,23.62 v40.08,23.37 | C21.2 62,12.42 62.74,11.68 v63.25,11.68 | C29.1 71.22,22 | X3.SHIELD1 85.73,31.63 75.06,20.95 71.75,20.95 70.81,21.91 | v48.26,25.91 46.99,24.64 46.99,19.91 R7.1 47.75,18.65 v47.75,17.78
  Top 0.254: 46.23,29.22 U1.11 | U1.13
  Top 0.305: C10.2 33,20.9 C12.1 v31,16.76 R40.1 C30.2 R16.2 | D9.C v46.48,12.5 D8.C | D8.C D7.C D6.C D5.C | 66.1,15 R22.2 | C10.2 33,27.94 | 33,27.94 33,30.75 31.75,32 C13.2 R14.1 31.71,34 v31.75,34.04 | R19.2 26.92,18.82 25.94,18.82 v25.65,18.54 | U3.35 17.75,43.31 v18.03,42.93 | v11.18,35.69 11.3,35.69 13.37,37.75 U3.47 16.67,37.75 v17.27,38.35 | C11.1 30.16,27.94 33,27.94 | 31.45,65.02 U4.9 29.11,65.17 28.25,64.32 v28.25,58.83 U4.4 | U1.15 48.25,27.93 v48.01,27.94 47.25,28.44 U1.13 47.25,30.22 46.99,30.48 46.48,30.48 46.25,30.25 U1.11 | 64.8,18.83 Y2.2 | C17.2 66.93,18.83 | 66.93,18.83 64.8,18.83 | C16.1 61.12,17.78 63.75,17.78 64.8,18.83 | R22.2 R38.1 | U1.32 56.75,28.34 62.23,22.86 70.04,22.86 C29.1 70.81,21.91 67.73,18.83 66.93,18.83 | Y3.4 71.25,44.45 71.63,44.45 73.08,43 | 73.08,43 Y3.2 73.73,43 74.68,43.94 74.68,45.47 73.14,47 C19.2 72.89,47 72.14,47.75 72.14,51.76 C28.2 71.88,53.98 71.88,58.02 C25.2 70.29,59 v69.6,59.69 69.6,62.99 | 73.08,43 73.1,42.98 C18.1 C8.2 | C8.2 C15.2 73.74,37 74.93,35.81 74.93,33.27 73.66,32 C14.2 | C6.2 70.05,67 69.6,66.55 69.6,62.99 | C24.2 70.35,63 69.85,62.99 69.6,62.99 | U1.1 41.25,27.43 | U1.4 42.75,28.02 42.16,27.43 41.25,27.43 | C10.2 33,20.85 33.78,20.07 38.97,20.07 C7.2 40.08,21.02 v40.08,23.37 | X3.P8 v75.51,40.06 74.45,39 C8.2 | C9.- 2.63,53 | U3.8 20.75,36.65 v20.07,37.34 | 41.25,27.43 40.08,26.26 40.08,23.62 | v48.51,11.18 48.01,11.18 47.75,11.43 47.75,12.25 D8.C | C5.2 29.67,43.43 29.21,43.43 28.15,44.49 R1.4 | 28.15,45.21 v26.67,45.21 | U3.23 26.33,42.25 v26.67,41.91 25.51,40.75 U3.20 | U2.12 45.31,63.6 v45.72,63.25 | D1.2 18.57,14 v18.54,13.97
  Top 0.305: U1.75 57.75,51.91 59.94,54.1 v59.94,57.66 59.94,61.72 v59.18,62.48 59.79,63.09 U7.4 | v58.17,63.75 57.52,64.4 U2.34 54.75,64.4 54.61,64.26 53.59,64.26 53.09,64.77 53.09,72.81 v51.27,74.63 | JP2.2 57.74,78.1 R20.2 R29.2 53.97,78.1 52.83,76.96 50.8,76.96 50,76.16 C20.2 51.14,74.76 | D10.C 36.07,12.43 v36.07,10.92 | U8.15 85.99,66.17 86.56,66.75 86.56,67.46 87.22,68.11 X1.6 | v80.77,19.56 79.28,19.56 U6.2 78.87,19.3 71.12,19.3 67.75,15.93 67.66,15.93 67.61,15.88 v67.23,15.88 66.78,15.88 R22.2 | R22.2 66.53,15.1 | v68.33,11.68 69,12.36 68.87,12.5 68.5,12.87 C2.2 | C17.2 67.31,18.59 | C17.2 67.18,18.72 | v68.45,19.05 67.15,19.05 C17.2
  Top 0.406: R1.4 28.15,45.21 R1.3 R1.2 R1.1 | R19.2 R16.2 C12.1 | v11.18,35.69 U5.1 8.98,36.07 5.08,36.07 3.9,34.89 C4.2 5.08,32.32 5.08,29.92 C3.- C1.- | 2.63,53 v2.03,53.59
  Bottom 0.203: v58.93,35.05 56.64,32.77 v56.64,30.73 | v45.72,63.25 49.78,67.31 49.78,73.15 v51.27,74.63 | v63.25,11.68 64.26,11.68 | v48.01,27.94 48.26,27.69 v48.26,25.91 | v40.08,23.37 45.66,17.78 v47.75,17.78 47.75,13.72 46.48,12.45 v46.48,12.5
  Bottom 0.305: X3.P10 X3.P11 91.58,44.09 90.42,42.93 85.73,42.93 | X3.SHIELD1 85.73,42.93 | 85.73,42.93 X3.SHIELD2 | v40.64,40.54 40.64,41.66 39.62,42.67 26.67,42.67 | J2.M2 10,54.54 JP3.3 15.49,49.05 15.49,44.7 17.27,42.93 v18.03,42.93 | X2.6 89.92,12.24 89.92,12.95 87.73,15.14 X2.3 84.33,16 v80.77,19.56 | v17.27,38.35 18.03,39.12 | 18.03,39.12 v18.03,42.93 | v20.07,37.34 18.29,39.12 18.03,39.12 | 26.67,42.67 v26.67,41.91 29.97,41.91 33.53,38.35 33.53,35.56 32,34.04 v31.75,34.04 | 26.67,42.67 v26.67,45.21 | v26.67,45.21 20.32,45.21 v18.03,42.93 | v26.67,45.21 25.91,45.97 25.91,56.48 v28.25,58.83 35.98,66.55 42.42,66.55 v45.72,63.25 | J1.4_GND 13.88,10.92 15.24,10.92 18.29,13.97 v18.54,13.97 23.11,18.54 v25.65,18.54 | J1.M2 13.24,1.74 S3.3 S3.4 | v58.17,63.75 58.17,63.5 v59.18,62.48 | v40.08,23.37 40.13,23.37 | v69.6,59.69 63.5,59.69 61.47,57.66 v59.94,57.66 | v36.07,10.92 35.31,10.92 32,14.22 32,16 31.24,16.76 v31,16.76 | v48.51,11.18 48.52,11.18 52.28,7.42 56.42,7.42 JP1.2 | v68.33,11.68 v63.25,11.68 | v68.45,19.05 67.18,17.78 v67.23,15.88
  Bottom 0.406: X1.6 90.38,68.11 91.95,66.55 91.95,59.18 91.28,58.51 X1.5 85.73,56.51 X3.SHIELD2 85.67,47.68 | 85.67,47.68 82.42,44.44 X3.P8 | 85.73,47.62 85.67,47.68 | J2.M1 10,62.74 | 10,62.74 10,58.17 | 10,58.17 J2.M2 | J1.M1 10,9.91 | 10,9.91 J1.M2 | J1.4_GND 10.16,9.75 10,9.91 | J2.4_GND 10.01,62.75 10,62.74 | v2.03,53.59 2.03,57.15 3.05,58.17 10,58.17
  pour Bottom: 0,80.01 0,0 100.08,0 100.08,80.01
N$1
  Top 0.305: U4.2 31.39,56.28 39.37,64.26 39.37,77.72 37.95,79.15 29.96,79.15 DS1.8
N$2
  Top 0.305: U4.11 32.16,67.72 33.02,68.58 33.02,74.33 DS1.9
N$3
  Top 0.305: U4.6 32.16,61.37 36.68,65.89 36.68,77.62 35.81,78.49 34.38,78.49 DS1.10
N$4
  Top 0.305: U4.7 32.16,62.63 34.04,64.52 34.04,75.61 DS1.11
N$6
  Top 0.305: U4.3 31.65,57.55 37.97,63.88 DS1.12
N$7
  Top 0.305: DS1.1 10.03,77.09 11.43,78.49 13.16,78.49 13.82,77.83 13.82,73.81 19.91,67.72 U4.14
N$8
  Top 0.305: DS1.2 12.7,76.87 12.7,72.64 20.17,65.17 U4.16
N$9  (via drill 0.36)
  Top 0.305: 22.3,60.2 U4.20 21.3,60.2 v18.29,60.2
  Bottom 0.305: v18.29,60.2 18.29,73.82 19,74.53 19,77.62 18.14,78.49 16.6,78.49 DS1.3
N$10  (via drill 0.36)
  Top 0.305: U4.23 19.66,56.28 v18.03,57.91
  Bottom 0.305: v18.03,57.91 17.53,58.42 17.53,76.88 DS1.4
N$11  (via drill 0.36)
  Top 0.305: U4.21 19.66,58.83 v19.05,59.44
  Bottom 0.305: v19.05,59.44 19.05,73.32 20.19,74.46 DS1.5
N$12
  Top 0.305: U4.15 22.76,66.44 23.62,67.31 23.62,76.11 DS1.6
N$13
  Top 0.305: U4.17 22.5,63.91 24.38,65.79 24.38,76.11 DS1.7
N$14
  Top 0.406: J1.1_VBUS 14.71,9.17 14.73,9.14 13.72,8.13 11.43,8.13 6.5,13.06 F1.1
N$15
  Top 0.406: F1.2 2.85,19.65 D2.A
N$16
  Top 0.203: Y4.2 27.52,24.98 | 27.52,24.98 27.94,24.56 27.94,25.15 | U3.5 19.25,33.84 27.52,25.57 27.52,24.98
  Top 0.406: C12.2 27.52,24.58 27.52,24.98
N$17
  Top 0.203: U3.6 19.75,34.1 25.85,28 C11.2 30.5,25.4 Y4.1
N$18
  Top 0.305: R21.2 22.76,54 23.37,54.61 23.37,61.98 22.71,62.63 U4.18
N$19
  Top 0.305: R18.2 D10.A
N$20
  Top 0.203: 6.1,42.92 R12.1 12.11,42.5 13.86,40.75 U3.41
N$21
  Top 0.203: 3.9,42.84 R12.2 5,41.4 12.19,41.4 13.34,40.25 U3.42
N$22
  Top 0.406: U5.2 U5.4 2.5,38.1 2.29,38.1 2.29,32.21 L1.1 C3.+
N$23
  Top 0.203: U3.25 22.75,45.72 26.03,49 R11.2
N$24
  Top 0.305: R17.2 38,16.5 D11.C
N$25
  Top 0.254: R4.1 15.75,53.15 15.75,56.39 16.51,57.15 16.51,64.26 15.52,65.25 J2.2_DM
N$26
  Top 0.254: R3.2 17.1,50 R5.1 15.24,51.66 15.24,56.9 16,57.66 16,63.25 15.24,64.01 13.95,64.01 J2.3_DP
N$27
  Top 0.305: C22.2 75.55,67.44 U8.1
N$28
  Top 0.406: F2.1 6.87,55.63 9.91,55.63 11.68,55.63 14.48,58.42 14.48,62.52 J2.1_VBUS
N$29
  Top 0.203: U3.7 20.25,34.36 24.61,30 R15.2
  Top 0.305: R15.2 C13.1
N$30
  Top 0.203: U1.39 59.95,32.25 59.94,32.26 59.69,32 59.69,30.99 60.68,30 R8.2
N$31
  Top 0.203: R9.2 50.04,21.14 50.04,22.1 49.25,22.89 U1.17
N$32
  Top 0.203: C22.1 72.03,63.87 72.03,62.47 72.53,61.98 73.92,61.98 76.84,64.91 U8.3
N$34
  Top 0.203: U3.2 17.75,32.03 28.68,21.1 R16.1
N$35
  Top 0.305: C23.2 74.21,61 76.83,63.63 | 76.83,63.63 76.84,63.63 | 76.83,63.63 78.92,63.63 U8.4
N$36
  Top 0.203: C23.1 70.9,60.93 71.81,60.02 74.75,60.02 77.22,62.48 78.81,62.48 U8.5
N$37
  Top 0.305: C25.1 75,59 77.1,61.09 U8.6
N$38
  Top 0.305: C24.1 76.28,66.17 U8.2
N$39
  Top 0.203: U2.39 55.63,69.09 | 55.63,69.09 U2.40 | R20.1 56.9,75 56.9,69.85 56.13,69.09 55.63,69.09
N$41  (via drill 0.36)
  Top 0.203: U1.12 46.75,27.67 v46.99,27.43 | v48.26,24.89 48.26,21.36 R7.2
  Bottom 0.203: v46.99,27.43 46.99,26.16 v48.26,24.89
N$42
  Top 0.305: R23.2 80.14,12.9 SJ1.1
N$45
  Top 0.305: R22.1 66.32,13.22 | 66.05,12.95 R22.1 | U6.8 84.51,20.91 79.86,16.26 70.36,16.26 69.72,15.62 69.72,14.48 69.22,13.97 67.69,13.97 66.62,12.9 R22.1
N$46
  Top 0.406: D3.A 5.08,48.07 5.08,54.1 3.5,55.68 F2.2
N$47
  Top 0.305: R28.2 42,18.5 D9.A
N$48
  Top 0.305: R27.2 47.4,15.5 D8.A
N$49
  Top 0.305: 50.4,15.5 D7.A | 50.79,15.5 D7.A | R26.2 46,18.26 47.5,16.76 49.28,16.76 50.54,15.5 D7.A
N$50
  Top 0.203: 59.94,12.85 59.89,12.9 R37.2 60.2,12.7 60.2,11.43 | R38.2 64.32,12.9 64.52,12.7 64.52,11.68 63.75,10.92 60.71,10.92 60.2,11.43 | 60.2,11.43 56.64,11.43 55.63,10.41 53.59,10.41 51.05,7.87 51.05,2.54 51.85,1.74 S1.4 S1.3
N$51
  Top 0.305: R25.2 52,17.5 D6.A
N$52
  Top 0.305: 56.39,15.51 56.4,15.5 56.64,15.5 | 57,15.9 D5.A 56.9,15.5 56.64,15.5 | R24.2 54,18.14 56.64,15.5
N$54
  Top 0.203: R34.1 83.57,34.47 83.57,36.07 82.8,36.83 81.79,36.83 79.89,38.73 X3.P4
  Top 0.305: R34.1 C29.2
N$55
  Top 0.203: 58,18.71 R36.2 59.78,17.12 67.54,17.12 70.87,20.45 75.31,20.45 85.6,30.73 86.36,30.73 87.68,32.05 89.71,32.05 92.96,35.31 92.96,45.47 94.05,46.55 94.3,46.55 X3.P12
N$56
  Top 0.203: 56.51,18.68 R35.2 56.03,18.9 56.9,18.03 57.4,18.03 58.8,16.64 67.69,16.64 70.99,19.94 75.56,19.94 85.85,30.23 86.51,30.23 87.78,31.5 92.42,31.5 X3.P9
N$57
  Top 0.305: X3.P6 81.18,43.19 81.18,45.11 77.29,49 C27.2
N$58
  Top 0.305: C26.2 84.58,45.52 84.58,40.25 X3.P3
N$61
  Top 0.305: R40.2 R39.2 33,9.55 30.48,7.03 30.48,3.81 32.55,1.74 S2.3 33.49,1.74
  Bottom 0.305: S2.3 S2.4
OE  (via drill 0.36)
  Top 0.203: 45.72,50.83 U1.99 45.75,53.06 45.21,53.59 v44.96,53.59 | U2.41 55.01,70 v54.1,69.09
  Bottom 0.203: v44.96,53.59 46.86,55.5 46.86,62.61 53.34,69.09 v54.1,69.09
OSC_IN
  Top 0.203: Y3.1 69.45,41.75 U1.58
  Top 0.305: Y3.1 70.7,41.2 C18.2
OSC_IN25
  Top 0.203: U1.29 55.25,28.06 60,23.31 C16.2 62.1,19 Y2.1
OSC_IN32
  Top 0.203: U1.37 70.15,31.25 C14.1
  Top 0.305: Y1.1 70.5,32.4 C14.1
OSC_OUT
  Top 0.203: U1.59 66.15,42.25 C19.1
  Top 0.305: C19.1 72.9,45 Y3.3
OSC_OUT25
  Top 0.203: U1.30 55.75,28.32 61.72,22.35 63.5,22.35 64.8,21.05 Y2.3 64.8,21.08
  Top 0.305: 64.8,21.08 64.82,21.1 C17.1
OSC_OUT32
  Top 0.203: U1.38 65.28,31.75 70.53,37 C15.1
  Top 0.305: C15.1 73.4,34.5 Y1.2
PB0  (via drill 0.36)
  Top 0.203: U1.118 46.79,44.25 v46.99,44.45 | v50.55,24.13 52.83,24.13 54.98,21.98 54.98,18.32 56.03,17.27 v56.64,17.27 57.4,17.27 59.58,15.1 59.94,15.1 R37.1 | JP1.20 76.54,10.16 58.17,10.16 v57.66,10.67
  Top 0.305: C21.1 59.94,15.1
  Bottom 0.203: v46.99,44.45 46.23,43.69 46.23,25.65 47.75,24.13 v50.55,24.13 | v56.64,17.27 56.64,11.68 v57.66,10.67
PB1  (via drill 0.36)
  Top 0.203: U1.117 45.77,44.75 v45.97,44.96 | v33.78,17.53 33,17.53
  Top 0.305: C10.1 33,17.53 R39.1
  Bottom 0.203: v45.97,44.96 45.97,45.47 44.7,46.74 43.69,46.74 42.16,48.26 40.39,48.26 39.88,47.75 39.88,45.72 43.18,42.42 43.18,31.24 34.29,22.35 34.29,18.03 v33.78,17.53 41.91,9.4 41.91,3.15 44.45,0.61 55.73,0.61 56.39,1.27 77.22,1.27 77.72,1.78 77.72,4.1 JP1.18
PB2  (via drill 0.36)
  Top 0.203: U1.116 44.74,45.25 v44.96,45.47 | v51.31,23.37 52.58,23.37 54,21.95 R24.1 | JP1.16 71.97,9.65 57.15,9.65 v56.64,10.16
  Bottom 0.203: v44.96,45.47 44.96,44.45 45.72,43.69 45.72,25.4 47.75,23.37 v51.31,23.37 52.32,23.37 53.09,22.61 53.09,13.72 v56.64,10.16
PB3  (via drill 0.36)
  Top 0.203: U1.115 43.72,45.75 v43.94,45.97 | v52.07,22.61 52,22.42 R25.1 | JP1.14 69.94,9.14 56.13,9.14 v55.63,9.65
  Bottom 0.203: v43.94,45.97 43.94,44.7 45.21,43.43 45.21,25.15 47.75,22.61 v52.07,22.61 52.32,22.35 52.32,12.95 v55.63,9.65
PB4  (via drill 0.36)
  Top 0.203: 39.22,46.23 U1.114 42.69,46.25 v42.93,46.48 | v45.72,22.86 46,22.58 R26.1 | JP1.12 67.9,8.64 55.12,8.64 v54.61,9.14
  Bottom 0.203: v42.93,46.48 42.93,44.96 44.7,43.18 44.7,23.88 v45.72,22.86 46.48,22.86 51.56,17.78 51.56,12.19 v54.61,9.14
PB5  (via drill 0.36)
  Top 0.203: U1.113 41.67,46.75 v41.91,46.99 | R27.1 44.7,21.8 v44.7,22.86 | JP1.10 65.87,8.13 54.1,8.13 v53.59,8.64
  Bottom 0.203: v41.91,46.99 41.91,45.21 44.2,42.93 44.2,23.37 v44.7,22.86 44.7,22.61 45.21,22.1 46.48,22.1 51.05,17.53 51.05,11.18 v53.59,8.64
PB6  (via drill 0.36)
  Top 0.203: U1.112 40.65,47.25 v40.89,47.5 | v43.69,22.86 42,21.17 R28.1 | JP1.8 63.84,7.62 53.09,7.62 v52.58,8.13
  Bottom 0.203: v40.89,47.5 40.89,45.47 43.69,42.67 v43.69,22.86 43.69,22.61 44.7,21.59 46.23,21.59 50.55,17.27 50.55,10.16 v52.58,8.13
PB10  (via drill 0.36)
  Top 0.203: U1.108 v39.37,50.8 | v32,50.8 31.5,50.8 27.43,54.86 27.43,67.56 28.85,68.98 U4.12 30.6,70.22 v31.75,71.37 | R42.2 44.94,76.96 42.42,76.96 41.15,75.69 v41.15,74.17
  Bottom 0.203: v39.37,50.8 v32,50.8 | v41.15,74.17 41.15,73.41 40.13,72.39 32.77,72.39 v31.75,71.37
PB11  (via drill 0.36)
  Top 0.203: R41.2 51.26,72.64 v52.07,71.88 | v60.71,68.07 60.75,68.03 U7.1 | v41.91,53.34 41.75,53.18 U1.107
  Bottom 0.203: v41.91,53.34 41.91,58.42 52.07,68.58 v52.07,71.88 53.59,73.41 60.71,73.41 | JP2.3 60.71,74.33 60.71,73.41 | 60.71,73.41 v60.71,68.07
PRMA+  (via drill 0.36)
  Top 0.203: U1.72 60.8,52.93 61.47,53.59 v61.47,59.18
  Bottom 0.203: JP2.11 70.21,73.67 70.21,68.68 61.47,59.94 v61.47,59.18
PRMA-  (via drill 0.36)
  Top 0.203: v60.71,59.94 60.71,53.59 58.75,51.64 U1.73
  Bottom 0.203: JP2.9 68.81,74.65 68.81,68.05 v60.71,59.94
RS232_CTS
  Top 0.305: X1.8 91.69,61.2 91.69,59.18 89.66,57.15 82.8,57.15 80.13,59.83 U8.7
RS232_RTS
  Top 0.305: X1.7 90.84,65.37 92.46,63.75 92.46,58.93 89.92,56.39 82.3,56.39 80.13,58.55 U8.8
RS232_RX
  Top 0.305: U8.14 85.89,64.91 X1.2
RS232_TX
  Top 0.305: U8.13 87.36,63.63 X1.3
SSP1_FSS  (via drill 0.36)
  Top 0.203: U1.64 62.78,44.75 64.26,46.23 64.26,68.83 66.29,70.87 76.96,70.87 v77.22,71.12
  Bottom 0.203: v77.22,71.12 77.22,71.88 75.08,74.02 75.08,76 JP2.14
SSP1_RXD
  Top 0.203: U1.62 63.31,43.75 65.28,45.72 65.28,60.2 65.79,60.71 65.79,61.98 65.28,62.48 65.28,68.33 66.8,69.85 80.26,69.85 82.8,72.39 82.8,75.44 82.3,75.95 80.77,75.95 79.45,77.27 78.99,77.27 | U7.2 59.84,65.64 59.18,66.29 59.18,67.56 65.02,73.41 71.88,73.41 72.54,74.07 72.54,77.83 73.2,78.49 77.78,78.49 78.99,77.27 | 78.99,77.27 JP2.18
SSP1_SCK  (via drill 0.36)
  Top 0.203: v54.1,44.2 54.16,44.25 U1.63 63.05,44.25 64.77,45.97 64.77,60.96 v65.02,61.21 64.77,61.47 64.77,68.58 66.55,70.36 79.25,70.36 80.26,71.37 80.26,75.18 79.5,75.95 77.67,75.95 JP2.16 | U4.13 21.4,77.53 22.35,78.49 25.91,78.49 26.52,77.88 26.52,54.46 31.19,49.78 32,49.78 v31.74,49.8 | v68.83,64.01 68.48,64.36 U7.6
  Bottom 0.203: v54.1,44.2 51.82,44.2 48.26,47.75 44.2,47.75 42.67,49.28 33.78,49.28 33.27,49.78 32,49.78 v31.74,49.8 | v68.83,64.01 68.83,63.5 66.55,61.21 v65.02,61.21
SSP1_TXD  (via drill 0.36)
  Top 0.203: v54.1,43.18 54.29,43.25 U1.61 63.57,43.25 65.79,45.47 65.79,59.94 66.29,60.45 66.29,62.23 65.79,62.74 65.79,62.99 | v32.77,49.02 32.77,54.1 31.85,55.02 U4.1 | 65.79,62.99 65.79,68.07 67.06,69.34 80.52,69.34 83.31,72.14 83.31,75.95 81.99,77.27 JP2.20 | 65.79,62.99 67.15,62.99 U7.5
  Bottom 0.203: v54.1,43.18 52.07,43.18 48.01,47.24 43.94,47.24 42.42,48.77 33.02,48.77 v32.77,49.02
SSP2_FSS
  Top 0.203: U1.68 60.81,46.74 61.72,46.74 62.23,47.24 62.23,69.85 65.28,72.9 72.9,72.9 73.81,73.81 JP2.13 73.81,74.57
SSP2_RXD  (via drill 0.36)
  Top 0.203: U1.66 62.26,45.75 63.25,46.74 63.25,69.34 65.79,71.88 75.69,71.88 v76.96,73.15
  Bottom 0.203: v76.96,73.15 77.22,73.41 80.52,73.41 81.43,74.32 JP2.19
SSP2_SCK
  Top 0.203: U1.67 62,46.25 62.74,46.99 62.74,69.6 65.53,72.39 74.01,72.39 JP2.15
SSP2_TXD
  Top 0.203: U1.65 62.52,45.25 63.75,46.48 63.75,69.09 66.04,71.37 76.45,71.37 78.89,73.81 JP2.17
ST_LED  (via drill 0.36)
  Top 0.203: U3.30 20.25,43 v20.32,42.93 | R18.1 36,23.18 34.29,24.89 v34.29,26.67
  Top 0.305: R17.1 R18.1
  Bottom 0.203: v34.29,26.67 33.27,27.69 30.99,27.69 20.32,38.35 v20.32,42.93
STUSB_DM
  Top 0.254: U3.32 19.25,45.41 20.57,46.74 20.57,50.55 19.12,52 R4.2
STUSB_DP
  Top 0.254: U3.33 18.75,45.67 20.07,46.99 20.07,49.53 19.6,50 R5.2
SWCLK
  Top 0.203: 15.49,42.81 U3.37 14.4,42.75 12,45.15 JP3.1
SWDIO
  Top 0.203: U3.34 18.25,46.01 17.53,46.74 16.51,46.74 13.25,50 JP3.2
T_JRST  (via drill 0.35, 0.36)
  Top 0.203: U1.142 34.81,32.25 31.5,35.56 31.5,37.08 30.78,37.8 R2.5 29.8,37.85 29.21,37.85 28.96,38.1 v28.96,41.15 | v26.67,40.64 26.28,40.25 U3.19
  Bottom 0.203: v26.67,40.64 27.18,41.15 v28.96,41.15
T_JTCK  (via drill 0.36)
  Top 0.203: R2.6 31.23,38.6 v31.75,38.1 32,37.85 32,35.81 35.07,32.75 U1.141 | U3.26 22.25,43.33 v21.84,42.93 | U3.15 26.52,38.25 v26.67,38.1
  Bottom 0.203: v21.84,42.93 v26.67,38.1 v31.75,38.1
T_JTDI  (via drill 0.36)
  Top 0.203: U1.139 36.1,33.75 32.77,37.08 32.77,38.35 31.75,39.37 v31.24,39.37 29.88,39.37 R2.7 | v26.66,39.38 26.53,39.25 U3.17
  Bottom 0.203: 30.98,39.64 v31.24,39.37 31.23,39.38 v26.66,39.38
T_JTDO  (via drill 0.35, 0.36)
  Top 0.203: U1.140 35.84,33.25 33.02,36.07 v32.77,36.07 | U3.16 22.75,38.75 v22.61,38.61
  Bottom 0.203: v32.77,36.07 32,36.07 30.99,37.08 24.13,37.08 v22.61,38.61
T_JTMS
  Top 0.203: U1.138 36.36,34.25 33.27,37.34 33.27,39.25 32.33,40.2 | U3.27 21.75,45.97 26.07,50.29 28.96,50.29 30.1,49.15 R11.1 29.7,49 28.96,48.26 28.96,44.45 29.21,44.2 30.73,44.2 32.33,42.6 32.33,40.2 | 32.33,40.2 R2.8
UART_CTS2  (via drill 0.36)
  Top 0.203: U1.50 64.93,37.75 v67.31,40.13 | v82.55,58.67 84.95,58.67 U8.9
  Bottom 0.203: JP1.17 78.91,2.73 79.98,3.81 79.98,6.12 72.14,13.97 72.14,19.56 67.31,24.38 v67.31,40.13 81.79,54.61 81.79,57.91 v82.55,58.67
UART_RTS2  (via drill 0.36)
  Top 0.203: U1.49 65.44,37.25 v68.33,40.13 | v82.55,59.94 84.95,59.94 U8.10
  Bottom 0.203: JP1.19 80.37,3.79 80.37,6.5 72.9,13.97 72.9,19.81 68.33,24.38 v68.33,40.13 83.31,55.12 83.31,59.18 v82.55,59.94
UART_RX1  (via drill 0.36)
  Top 0.203: U1.102 44.25,48.97 v46.74,46.48
  Bottom 0.203: v46.74,46.48 49.78,43.43 49.78,26.67 59.18,17.27 59.18,7.2 JP1.4
UART_RX2  (via drill 0.36)
  Top 0.203: U1.53 64.4,39.25 v65.28,40.13 | v82.55,62.48 84.95,62.48 U8.12
  Bottom 0.203: JP1.13 72.64,3.9 72.64,5.84 70.61,7.87 70.61,19.05 65.28,24.38 v65.28,40.13 80.77,55.63 80.77,60.96 82.3,62.48 v82.55,62.48
UART_TX1  (via drill 0.36)
  Top 0.203: U1.101 44.75,49.48 v47.75,46.48
  Bottom 0.203: v47.75,46.48 50.29,43.94 50.29,26.92 59.94,17.27 59.94,8.98 JP1.6
UART_TX2  (via drill 0.36)
  Top 0.203: U1.52 64.91,38.75 v66.29,40.13 | v82.55,61.21 84.95,61.21 U8.11
  Bottom 0.203: JP1.15 75.18,3.9 75.18,5.84 71.37,9.65 71.37,19.3 66.29,24.38 v66.29,40.13 81.28,55.12 81.28,59.94 v82.55,61.21
USB_D+
  Top 0.305: J1.3_DP 13.89,11.07 16.26,11.07 18.23,13.05 D1.3
USB_D-
  Top 0.305: J1.2_DM 17.41,14.95 D1.1
USB_DM  (via drill 0.36)
  Top 0.203: v36.32,27.69 36.83,27.69 45.47,36.32 56.64,36.32 58.71,34.25 U1.43 | D1.6 23.59,14.95 v24.13,15.49
  Bottom 0.203: v36.32,27.69 v24.13,15.49
USB_DP  (via drill 0.36)
  Top 0.203: v36.32,26.67 36.58,26.67 45.72,35.81 56.39,35.81 58.45,33.75 U1.42 | D1.4 24.03,13.05 v24.38,12.7
  Bottom 0.203: v24.38,12.7 24.38,14.73 v36.32,26.67
VBUS
  Top 0.305: 7,22.5 14.84,22.5 21.08,16.26 21.08,14.48 21.56,14 D1.5 22.21,13.99 66.74,13.99 67.86,15.1 C2.1 68.5,15.67 71.2,18.36 71.77,18.36 71.88,18.36 U6.3
  Top 0.406: D2.C 7,22.5 C1.+ 3.46,26 1.02,28.45 1.02,40.14 1.52,40.65 | 1.52,40.65 8.76,40.65 U5.3 | 1.52,40.65 1.52,44.67 D3.C D4.A
VDDA  (via drill 0.36)
  Top 0.203: C7.1 41,19.9 41,25.36 43.25,27.62
  Top 0.305: C7.1 40,17.5 L2.2 | C8.1 67.15,35.25 U1.45 59.75,35.25 56.9,38.1 49.02,38.1 v48.77,37.85 | 48.75,30.46 U1.16 48.75,27.41 48.01,26.67 45.72,26.67 | 48.75,30.46 v48.26,30.73 | U1.14 47.75,30.27 47.94,30.46 48.75,30.46 | 45.72,26.67 44.2,26.67 43.25,27.62 U1.5 | U1.10 45.75,26.7 45.72,26.67
  Bottom 0.305: v48.26,30.73 48.26,37.34 v48.77,37.85
WE
  Top 0.203: 46.23,50.82 U1.98 46.25,53.32 45.21,54.36 42.93,54.36 42.16,55.12 42.16,58.17 43.6,59.6 U2.17

## Text on the board
tNames: VCC G | B11 D9 | D2 F8 | D1 F7 | C14 F4 | C13 F3 | C12 C8 | C11 C7 | C9 C6 | C10 C5 | USB-DEBUG | RS-232 | SWCK SWDIO GND | K1986BE1QI | CAN | Milandr / Development / Board / K1986BE1 | Dbg | RESET | USB-DEVICE | VCC G | E11 C4 | E12 C3 | E13 B6 | E14 B5 | E2 B4 | D14 B3 | D13 B2 | D11 B1 | D10 B0
bNames: JP2 / Port Main Alt Over Use | JP1 / Port Main Alt Over Use | PB11 D27 IN6- T2.C2N w25CS / PD1 PRDA+ CLE A15 RAM / PD2 PRDA- S1.TX A14 RAM / PC9 S2.TX BE0 Can1.RX / PC10 S2.RX BE1 Can1.TX / PC11 S2.CK BE2 Can2.RX / PC12 S2.FS BE3 Can2.TX / PC13 PRMA+ A30 U2.TX / PC14 PRMA- A31 U2.RX | PB0 D16 IN1+ T3.C1 Btn1 / PB1 D17 IN1- T3.C1N Btn2 / PB2 D18 IN2+ T3.C2 Led / PB3 D19 IN2- T3.C2N Led / PB4 D20 IN3+ T3.C3 Led / PB5 D21 IN3- T3.C3N Led / PB6 D22 IN4+ T3.C4 Led / PC3 U1.TX CLE IR1.Out / PC4 U1.RX BSY IR1.In | PD9 S2.SCK DSR2 A2 ADC2 / PC5 Ext1 S1.TX S1.RX SSP1 / PC6 Ext2 S1.RX S1.TX SSP1 / PC7 Ext3 S1.CK FXEN SSP1 / PC8 Ext4 S1.FS FTX / PF3 PRMC+ A0 T1.CH1 / PF4 PRMC- A1 T1.CH2 RAM / PF7 PRDC+ A4 Out4+ RAM / PF8 PRDC- A5 Out4- RAM | PD10 S2.FSS RTS2 A1 UART2 / PD11 A0 CTS2 UART2 / PD13 U2.TX Out1+ IR2.Out UART2 / PD14 U2.RX Out1- IR2.In UART2 / PE2 Out4- A16 DAC1 / PE11 Can1.RX A25 CAN1 / PE12 Can1.TX A26 CAN1 / PE13 Can2.RX A27 / PE14 Can2.TX A28 | Y1 Y2 Y3 Y4 / 32kHz 25MHz 16MHz 8MHz | CCCP | https://makbit.com / https://github.com/makbit | 2019 (c) MakBit Software / Made in Russia